# EAGLE schematic FTDI_PROG (EAGLE 5.10)
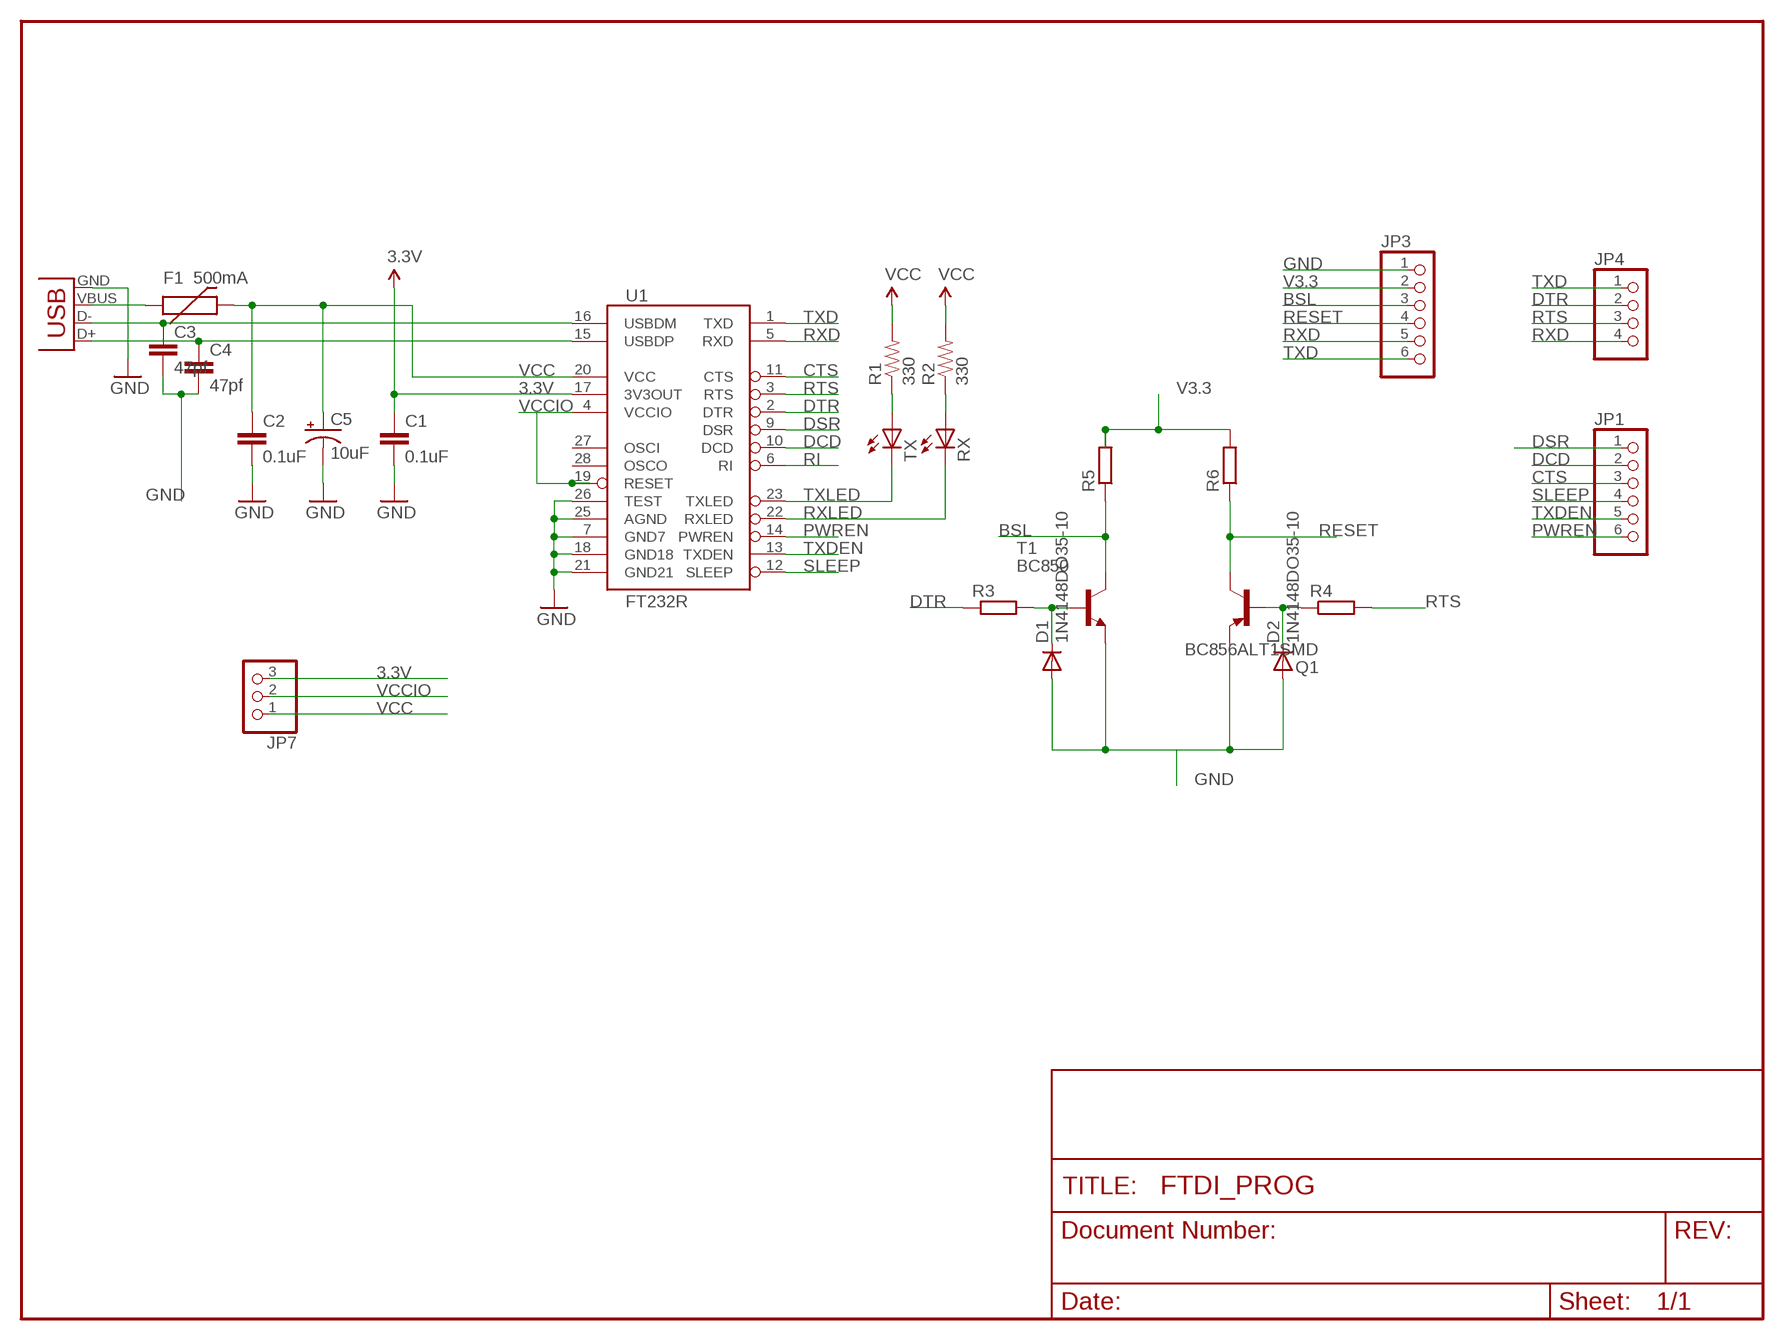
[diagram p0: schematic, sheet 1]

## Parts
C1  0.1uF  CAP1206  [1206]
C2  0.1uF  CAP1206  [1206]
C3  47pf  C-EU025-024X044  [C025-024X044]
C4  47pf  C-EU025-025X050  [C025-025X050]
C5  10uF  CAP_POLPTH1  [CPOL-RADIAL-100UF-25V]
D1  1N4148DO35-10  [DO35-10]
D2  1N4148DO35-10  [DO35-10]
F1  500mA  PTCSMD  [PTC-1206]
JP1  PINHD-1X6  [1X06]
JP3  PINHD-1X6  [1X06]
JP4  PINHD-1X4  [1X04]
JP7  PINHD-1X3  [1X03]
Q1  BC856ALT1SMD  [SOT23-BEC]
R1  330  RESISTOR1206  [1206]
R2  330  RESISTOR1206  [1206]
R3  R-EU_0207/10  [0207/10]
R4  R-EU_0207/10  [0207/10]
R5  R-EU_0207/10  [0207/10]
R6  R-EU_0207/10  [0207/10]
RX  LED1206  [LED-1206]
T1  BC850  [SOT23]
TX  LED1206  [LED-1206]
U1  FT232R  FT232RLSSOP  [SSOP28DB]
X2  USBPTH  [USB-B-PTH]

## Nets
3.3V [power]: C1.1 JP7.3 U1.17(3V3OUT)
BSL: JP3.3 R5.1 T1.3(C)
CTS: JP1.3 U1.11(CTS)
DCD: JP1.2 U1.10(DCD)
DSR: JP1.1 U1.9(DSR)
DTR: JP4.2 R3.1 U1.2(DTR)
GND [power]: C1.2 C2.2 C3.2 C4.2 C5.2(-) D1.A D2.A JP3.1 Q1.E T1.2(E) U1.7(GND7) U1.18(GND18) U1.21(GND21) U1.25(AGND) U1.26(TEST) X2.GND
N$1: R1.1 TX.A
N$2: R2.1 RX.A
N$3: F1.1 X2.VBUS
N$4: D1.C R3.2 T1.1(B)
N$5: D2.C Q1.B R4.1
PWREN: JP1.6 U1.14(PWREN)
RESET: JP3.4 Q1.C R6.1
RI: U1.6(RI)
RTS: JP4.3 R4.2 U1.3(RTS)
RXD: JP3.5 JP4.4 U1.5(RXD)
RXLED: RX.C U1.22(RXLED)
SLEEP: JP1.4 U1.12(SLEEP)
TXD: JP3.6 JP4.1 U1.1(TXD)
TXDEN: JP1.5 U1.13(TXDEN)
TXLED: TX.C U1.23(TXLED)
USB_D+: C4.1 U1.15(USBDP) X2.D+
USB_D-: C3.1 U1.16(USBDM) X2.D-
V3.3: JP3.2 R5.2 R6.2
VCC [power]: C2.1 C5.1(+) F1.2 JP7.1 R1.2 R2.2 U1.20(VCC)
VCCIO: JP7.2 U1.4(VCCIO) U1.19(RESET)
Unconnected: U1.27(OSCI) U1.28(OSCO)

## Library data of the parts
C1 C2 = SparkFun:CAP: Capacitor Standard 0603 ceramic capacitor, and 0.1" leaded capacitor.
C3 C4 = rcl:C-EU: CAPACITOR, European symbol
C5 = SparkFun:CAP_POL: Capacitor Polarized These are standard SMD and PTH capacitors. Normally 10uF, 47uF, and 100uF in electrolytic and tantalum varieties. Always verify the external diameter of the through hole cap, it varies with capacity, voltage, and manufacturer. The EIA devices should be standard.
D1 D2 = diode:1N4148: DIODE high speed (Philips)
F1 = SparkFun:PTC: Resettable Fuse PTC Resettable Fuse. Spark Fun Electronics SKU : COM-08357
JP1 JP3 = pinhead:PINHD-1X6: PIN HEADER
JP4 = pinhead:PINHD-1X4: PIN HEADER
JP7 = pinhead:PINHD-1X3: PIN HEADER
Q1 = transistor-pnp:BC856*: PNP Transistror
R1 R2 = SparkFun:RESISTOR: Resistor Basic schematic elements and footprints for 0603, 1206, and PTH 1/10th watt (small) resistors.
R3-R6 = resistor:R-EU_: RESISTOR, European symbol
RX TX = SparkFun:LED: LEDs Standard schematic elements and footprints for 5mm, 3mm, 1206, and 0603 sized LEDs. 5mm - Spark Fun Electronics SKU : COM-00529 (and others)
T1 = transistor:BC850: NPN TRANSISTOR
U1 = SparkFun:FT232RL: USB UART FT232RL 4th Generation USB UART (USB <-> Serial) Controller. Spark Fun Electronics SKU : COM-00650
X2 = SparkFun:USB: USB Connectors USB-B-PTH is fully proven SKU : PRT-00139 USB-miniB is fully proven SKU : PRT-00587 USB-A-PCB is untested. USB-A-H is throughly reviewed, but untested. Spark Fun Electronics SKU : PRT-00437 USB-B-SMT is throughly reviewed, but untested. Needs silkscreen touching up. USB-A-S has not been used/tested USB-MB-H has not been used/tested

## Net classes
0 default: width 0.203 mm
1 power: width 0.254 mm